# EAGLE design phychip_plugin_board (EAGLE 6.6.0)
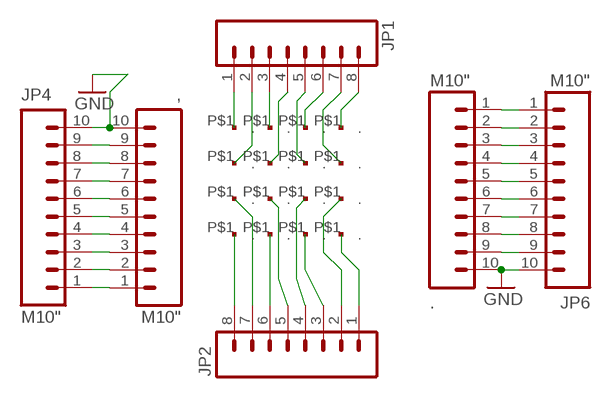
[diagram p0: schematic, sheet 1]

## Parts
,  M10"  [1X10]
.  M10"  [1X10]
JP1  M08  [1X08]
JP2  M08  [1X08]
JP4  M10"  [1X10]
JP6  M10"  [1X10]
U$1  MEAPAD  [MEAPAD1MM]
U$2  MEAPAD  [MEAPAD1MM]
U$3  MEAPAD  [MEAPAD1MM]
U$4  MEAPAD  [MEAPAD1MM]
U$5  MEAPAD  [MEAPAD1MM]
U$6  MEAPAD  [MEAPAD1MM]
U$7  MEAPAD  [MEAPAD1MM]
U$8  MEAPAD  [MEAPAD1MM]
U$9  MEAPAD  [MEAPAD1MM]
U$10  MEAPAD  [MEAPAD1MM]
U$11  MEAPAD  [MEAPAD1MM]
U$12  MEAPAD  [MEAPAD1MM]
U$13  MEAPAD  [MEAPAD1MM]
U$14  MEAPAD  [MEAPAD1MM]
U$15  MEAPAD  [MEAPAD1MM]
U$16  MEAPAD  [MEAPAD1MM]

## Nets
GND: ,.10 ..10 JP4.10 JP6.10
N$1: JP1.4 U$6.P$1(.)
N$2: JP1.5 U$7.P$1(.)
N$3: JP1.3 U$2.P$1(.)
N$4: JP1.6 U$3.P$1(.)
N$5: JP1.2 U$5.P$1(.)
N$6: JP1.1 U$1.P$1(.)
N$7: JP1.7 U$8.P$1(.)
N$8: JP1.8 U$4.P$1(.)
N$9: JP2.5 U$10.P$1(.)
N$10: JP2.4 U$11.P$1(.)
N$11: JP2.6 U$14.P$1(.)
N$12: JP2.3 U$15.P$1(.)
N$13: JP2.7 U$9.P$1(.)
N$14: JP2.2 U$12.P$1(.)
N$15: JP2.1 U$16.P$1(.)
N$16: JP2.8 U$13.P$1(.)
N$17: ..1 JP6.1
N$18: ,.1 JP4.1
N$19: ,.2 JP4.2
N$20: ,.3 JP4.3
N$21: ,.4 JP4.4
N$22: ,.5 JP4.5
N$23: ,.6 JP4.6
N$24: ,.7 JP4.7
N$25: ,.8 JP4.8
N$26: ,.9 JP4.9
N$28: ..2 JP6.2
N$29: ..3 JP6.3
N$30: ..4 JP6.4
N$31: ..5 JP6.5
N$32: ..6 JP6.6
N$33: ..7 JP6.7
N$34: ..8 JP6.8
N$35: ..9 JP6.9

## Library data of the parts
, . JP4 JP6 = SparkFun:M10: Header 10 Standard 10-pin 0.1" header. Use with straight break away headers (SKU : PRT-00116), right angle break away headers (PRT-00553), swiss pins (PRT-00743), machine pins (PRT-00117), and female headers (PRT-00115).
JP1 JP2 = SparkFun:M08: Header 8 Standard 8-pin 0.1" header. Use with straight break away headers (SKU : PRT-00116), right angle break away headers (PRT-00553), swiss pins (PRT-00743), machine pins (PRT-00117), and female headers (PRT-00115).
U$1-U$16 = phychippads:MEAPAD

## Board
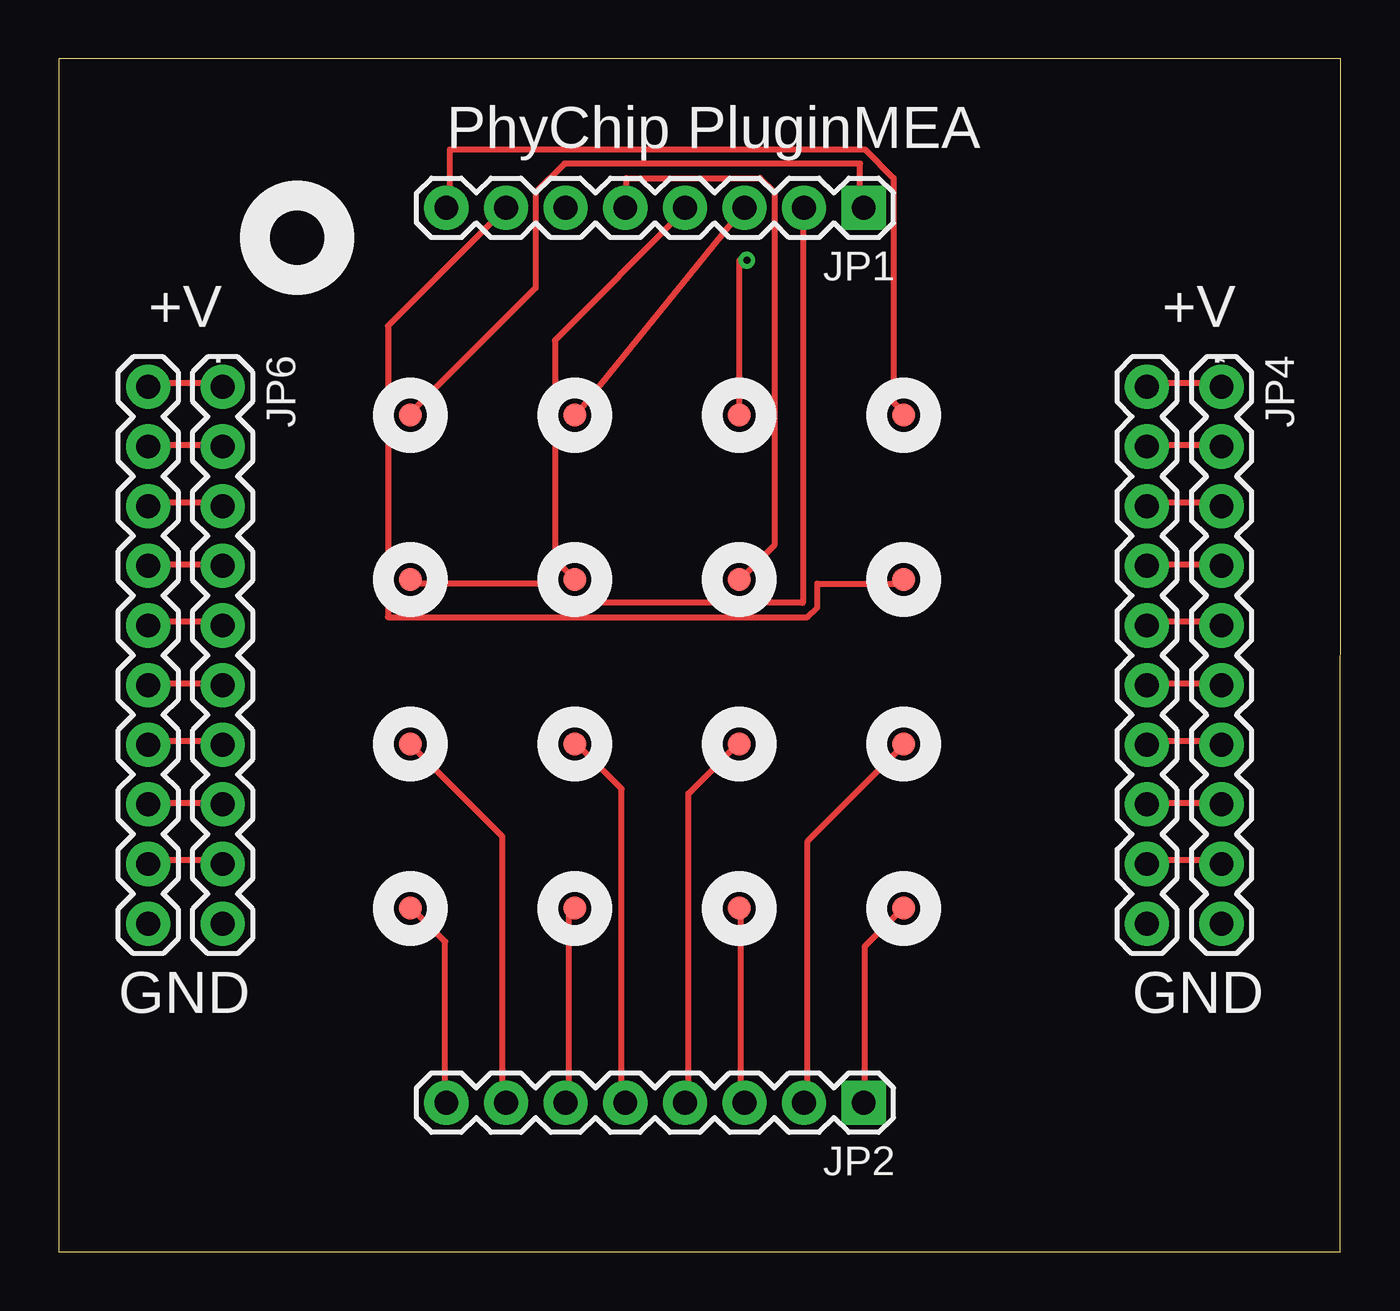
[diagram p1: board, top side]
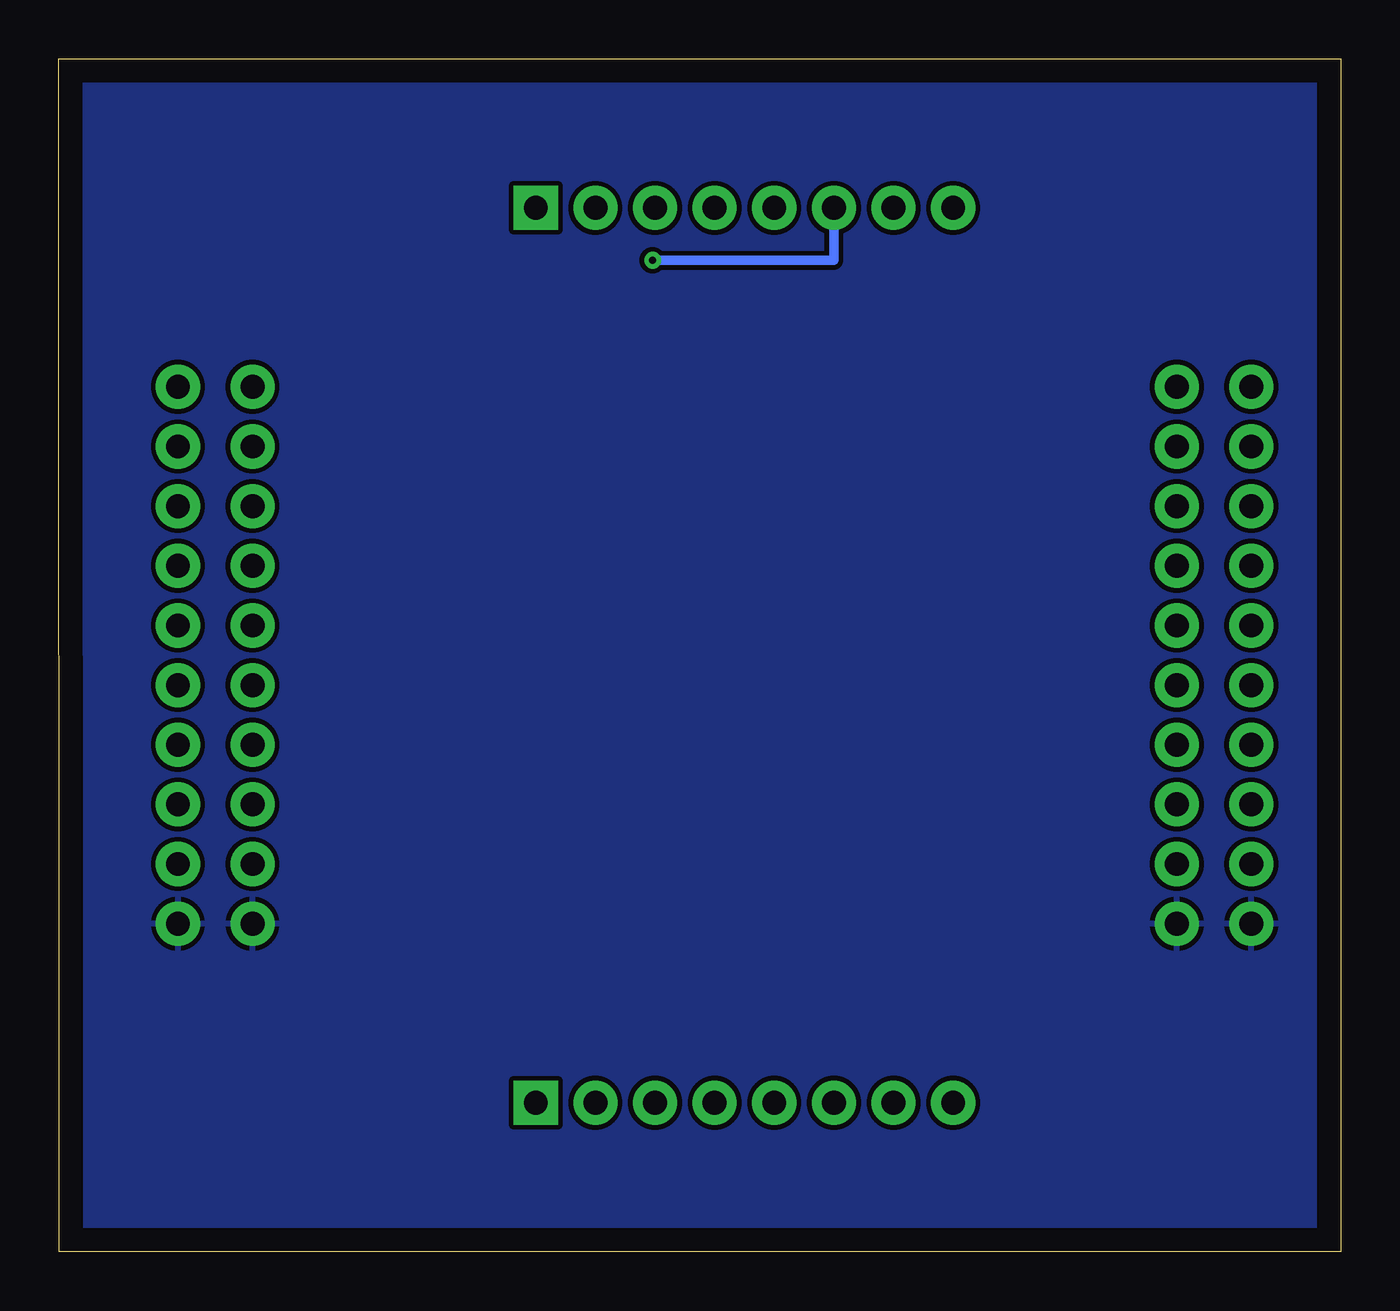
[diagram p2: board, bottom side, seen from below]

Size 54.61 x 50.8 mm. Coordinates in mm from the lower left corner, seen from the top.
Outline: 0,0 54.59,0 54.61,50.8 0,50.8 0,0
Copper layers (1*16): Top 0.035mm / dielectric 1.5mm / Bottom 0.035mm
Design rules "default *": minimum track width 10mil, minimum drill 12mil, track to track 8mil, track to pad 8mil, pad to pad 8mil, via to via 8mil, smd to smd 8mil, copper to edge 40mil, drill to drill 8mil, minimum pad ring 10mil, minimum via ring 8mil, stop-mask expansion 4mil, vias tented up to drill 13mil, thermal gap 8mil

### Footprints (pad centres in the part's own frame; a part is rotated, then mirrored left to right if it is on the bottom)
1X10 = drill 1.016 pad 1.88: 1 0,0; 2 2.54,0; 3 5.08,0; 4 7.62,0; 5 10.16,0; 6 12.7,0; 7 15.24,0; 8 17.78,0; 9 20.32,0; 10 22.86,0
1X08 = drill 1.016 pad 1.88 square: 1 0,0 | drill 1.016 pad 1.88: 2 2.54,0; 3 5.08,0; 4 7.62,0; 5 10.16,0; 6 12.7,0; 7 15.24,0; 8 17.78,0
MEAPAD1MM = smd 0.991 x 0.991: P$1 0,0

### Placement (x,y rotation side)
,  46.35,36.83 270 top
.  3.81,36.83 270 top
JP1  34.29,44.45 180 top
JP2  34.29,6.35 180 top
JP4  49.53,36.83 270 top
JP6  6.99,36.83 270 top
U$1  14.99,35.62 0 top
U$2  21.99,35.62 0 top
U$3  28.99,35.62 0 top
U$4  35.99,35.62 0 top
U$5  14.99,28.62 0 top
U$6  21.99,28.62 0 top
U$7  28.99,28.62 0 top
U$8  35.99,28.62 0 top
U$9  14.99,21.62 90 top
U$10  21.99,21.62 0 top
U$11  28.99,21.62 0 top
U$12  35.99,21.62 0 top
U$13  14.99,14.65 90 top
U$14  21.99,14.65 0 top
U$15  28.99,14.65 0 top
U$16  35.99,14.65 0 top

### Tracks (layer width: path | path; a pad name or v marks a point on that pad's centre or on a via)
GND
  pour Bottom: 0,0 0,50.8 54.61,50.8 54.61,0
N$1
  Top 0.254: U$6.P$1 21.95,28.65 21.13,29.46 21.13,38.81 26.62,44.3 JP1.4
N$2
  Top 0.254: U$7.P$1 29.06,28.65 30.48,30.07 30.48,45.11 29.87,45.72 24.18,45.72 24.18,44.5 JP1.5
N$3
  Top 0.254: U$2.P$1 22.15,35.76 27.53,42.42 29.06,44.3 JP1.3
N$4  (via drill 0.3)
  Top 0.254: 28.85,35.76 U$3.P$1 28.99,42.22 v29.31,42.22
  Bottom 0.406: v29.31,42.22 21.59,42.22 JP1.6
N$5
  Top 0.254: U$5.P$1 15.04,28.45 21.13,28.45 21.13,28.25 21.74,27.64 31.7,27.64 31.7,44.3 JP1.2
N$6
  Top 0.254: U$1.P$1 15.04,35.76 20.32,41.05 20.32,45.11 21.54,46.33 34.14,46.33 34.14,44.5 JP1.1
N$7
  Top 0.254: JP1.7 14.02,39.42 14.02,27.03 31.9,27.03 32.31,27.43 32.31,28.45 35.97,28.45 U$8.P$1
N$8
  Top 0.254: U$4.P$1 35.97,35.76 35.56,36.17 35.56,45.72 34.34,46.94 16.66,46.94 16.66,44.5 JP1.8
N$9
  Top 0.254: U$10.P$1 22.15,21.54 23.98,19.71 23.98,6.5 JP2.5
N$10
  Top 0.254: U$11.P$1 28.85,21.54 26.82,19.51 26.82,6.5 JP2.4
N$11
  Top 0.254: U$14.P$1 21.95,14.63 21.74,14.43 21.74,6.5 JP2.6
N$12
  Top 0.254: U$15.P$1 29.06,14.63 29.06,6.5 JP2.3
N$13
  Top 0.254: U$9.P$1 15.04,21.54 18.9,17.68 18.9,6.5 JP2.7
N$14
  Top 0.254: U$12.P$1 35.97,21.54 31.9,17.48 31.9,6.5 JP2.2
N$15
  Top 0.254: U$16.P$1 35.97,14.63 34.34,13.01 34.34,6.5 JP2.1
N$16
  Top 0.254: U$13.P$1 15.04,14.63 16.46,13.21 16.46,6.5 JP2.8
N$17
  Top 0.254: ..1 3.86,36.98 6.91,36.98 JP6.1
N$18
  Top 0.254: ,.1 46.53,36.98 49.38,36.98 JP4.1
N$19
  Top 0.254: ,.2 46.53,34.34 49.38,34.34 JP4.2
N$20
  Top 0.254: ,.3 46.53,31.9 49.38,31.9 JP4.3
N$21
  Top 0.254: ,.4 46.53,29.26 49.38,29.26 JP4.4
N$22
  Top 0.254: ,.5 46.53,26.82 49.38,26.82 JP4.5
N$23
  Top 0.254: ,.6 46.53,24.18 49.38,24.18 JP4.6
N$24
  Top 0.254: ,.7 46.53,21.74 49.38,21.74 JP4.7
N$25
  Top 0.254: ,.8 46.53,19.1 49.38,19.1 JP4.8
N$26
  Top 0.254: ,.9 46.53,16.66 49.38,16.66 JP4.9
N$28
  Top 0.254: ..2 3.86,34.34 6.91,34.34 JP6.2
N$29
  Top 0.254: ..3 3.86,31.9 6.91,31.9 JP6.3
N$30
  Top 0.254: ..4 3.86,29.26 6.91,29.26 JP6.4
N$31
  Top 0.254: ..5 3.86,26.82 6.91,26.82 JP6.5
N$32
  Top 0.254: ..6 3.86,24.18 6.91,24.18 JP6.6
N$33
  Top 0.254: ..7 3.86,21.74 6.91,21.74 JP6.7
N$34
  Top 0.254: ..8 3.86,19.1 6.91,19.1 JP6.8
N$35
  Top 0.254: ..9 3.86,16.66 6.91,16.66 JP6.9

### Text on the board
tPlace: +V | +V | GND | GND
tNames: PhyChip PluginMEA